# EAGLE schematic riffle-0.3 (EAGLE 7.2.0)
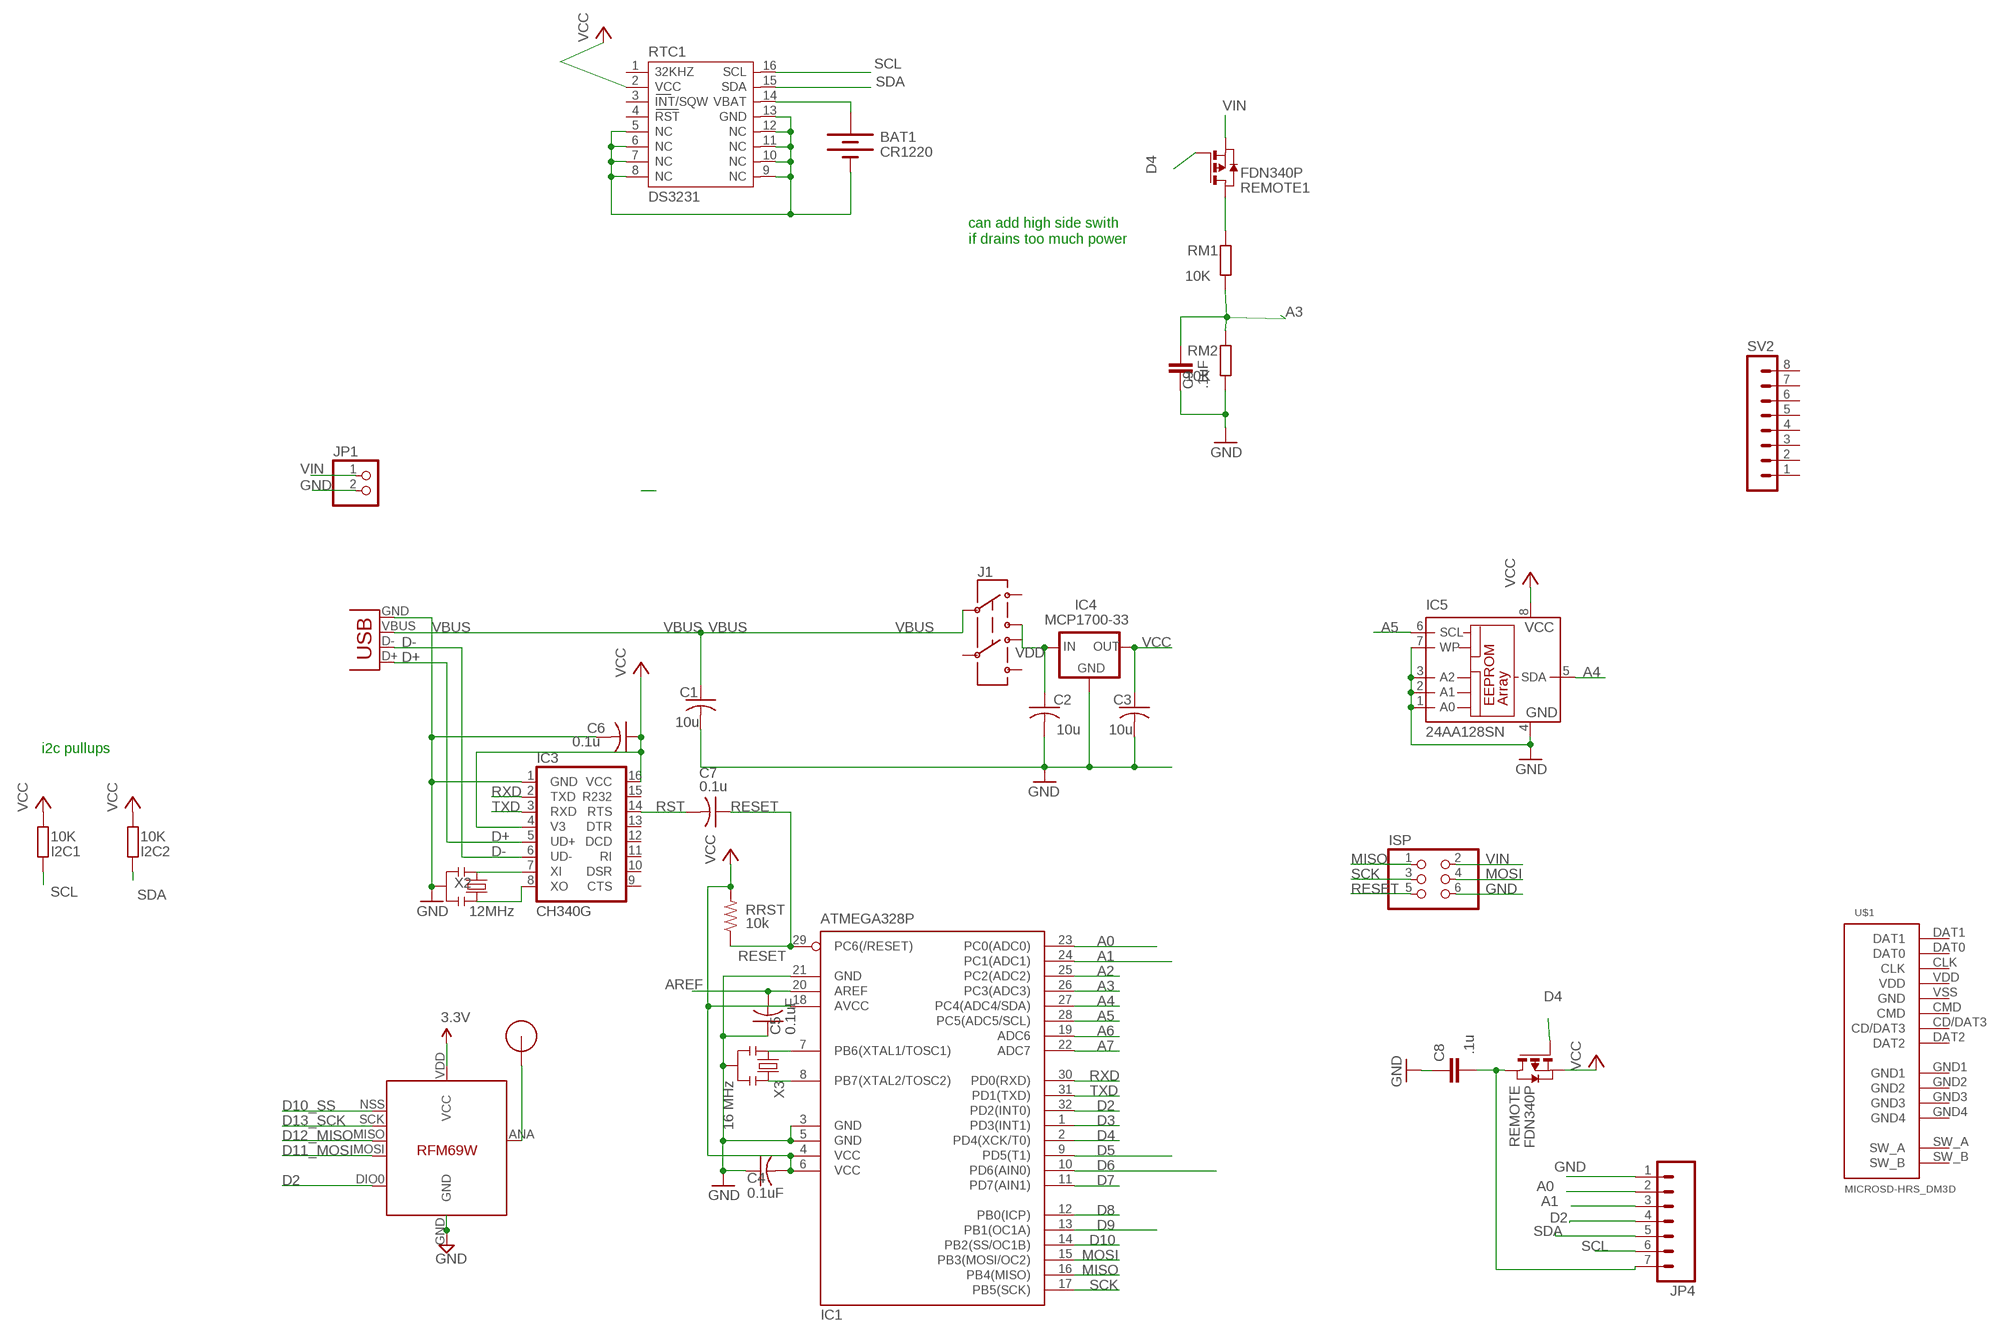
[diagram p0: schematic, sheet 1]

## Parts
BAT1  CR1220  BATTERYBATTERY_12MM_SMT  [BATTCON_12MM_SMT]
C1  10u  C-USC0805K  [C0805K]
C2  10u  C-USC0805K  [C0805K]
C3  10u  C-USC0805K  [C0805K]
C4  0.1uF  C-USC0805K  [C0805K]
C5  0.1uF  C-USC0805K  [C0805K]
C6  0.1u  C-USC0805K  [C0805K]
C7  0.1u  C-USC0805K  [C0805K]
C8  .1u  C-EUC0805  [C0805]
C9  .1uF  C-EUC0805  [C0805@1]
I2C1  10K  R-EU_R0805  [R0805]
I2C2  10K  R-EU_R0805  [R0805]
IC1  ATMEGA328P  MEGA8-AI  [TQFP32-08]
IC3  CH340G  [SO16]
IC4  MCP1700-33  MCP1700SOT89  [SOT89]
IC5  24AA128SN  [SO-08]
ISP  PINHD-2X3  [2X03]
J1  AYZ0202  [AYZ0202]
JP1  PINHD-1X2  [1X02]
JP4  M07  [1X07]
REMOTE  FDN340P  PMOSSOT23  [SOT-23]
REMOTE1  FDN340P  PMOSSOT23  [SOT-23]
RM1  10K  R-EU_R0805  [R0805]
RM2  10K  R-EU_R0805  [R0805]
RRST  10k  R-US_R0805  [R0805]
RTC1  DS3231  [DS3231]
SV2  MA08-1  [MA08-1]
U$1  MICROSD-HRS_DM3D  [DM3D]
U$3  RFM12B_ANTENNA  [RFM12B-ANTENNA]
U$5  RFM69  [RFM69W-MINPADS]
X1  USBSMD  [USB-MINIB]
X2  12MHz  RESONATORSMD  [RESONATOR-SMD]
X3  16 MHz  RESONATORSMD  [RESONATOR-SMD]

## Nets
A0: IC1.23(PC0(ADC0)) JP4.2
A1: IC1.24(PC1(ADC1)) JP4.3
A2: IC1.25(PC2(ADC2))
A3: C9.2 IC1.26(PC3(ADC3)) RM1.1 RM2.2
A4: IC1.27(PC4(ADC4/SDA)) IC5.5(SDA)
A5: IC1.28(PC5(ADC5/SCL)) IC5.6(SCL)
A6: IC1.19(ADC6)
A7: IC1.22(ADC7)
AREF: C5.2 IC1.20(AREF)
D2: IC1.32(PD2(INT0)) JP4.4 U$5.DIO0
D3: IC1.1(PD3(INT1))
D4: IC1.2(PD4(XCK/T0)) REMOTE1.3(G) REMOTE.3(G)
D5: IC1.9(PD5(T1))
D6: IC1.10(PD6(AIN0))
D7: IC1.11(PD7(AIN1))
D8: IC1.12(PB0(ICP))
D9: IC1.13(PB1(OC1A))
D10: IC1.14(PB2(SS/OC1B))
D10_SS: U$5.NSS(SEL)
D11_MOSI: U$5.MOSI
D12_MISO: U$5.MISO
D13_SCK: U$5.SCK
D+: IC3.5(UD+) X1.D+
D-: IC3.6(UD-) X1.D-
GND: BAT1.P$1(-) C1.2 C2.2 C3.2 C4.1 C5.1 C6.2 C8.1 C9.1 IC1.3(GND) IC1.5(GND) IC1.21(GND) IC3.1(GND) IC4.1(GND) IC5.1(A0) IC5.2(A1) IC5.3(A2) IC5.4(GND) IC5.7(WP) ISP.6 JP1.2 JP4.1 RM2.1 RTC1.5(NC) RTC1.6(NC) RTC1.7(NC) RTC1.8(NC) RTC1.9(NC) RTC1.10(NC) RTC1.11(NC) RTC1.12(NC) RTC1.13(GND) U$5.GND X1.GND X2.2 X3.2
MISO: IC1.16(PB4(MISO)) ISP.1
MOSI: IC1.15(PB3(MOSI/OC2)) ISP.4
N$1: U$3.P$1 U$5.ANA(ANT)
N$2: IC1.7(PB6(XTAL1/TOSC1)) X3.1
N$3: IC1.8(PB7(XTAL2/TOSC2)) X3.3
N$4: REMOTE1.1(D) RM1.2
N$7: C8.2 JP4.7 REMOTE.1(D)
N$11: IC3.7(XI) X2.1
N$13: IC3.8(XO) X2.3
RESET: C7.1 IC1.29(PC6(/RESET)) ISP.5 RRST.1
RST: C7.2 IC3.14(RTS)
RTC_BATT1: BAT1.P$2(+) RTC1.14(VBAT)
RXD: IC1.30(PD0(RXD)) IC3.2(TXD)
SCK: IC1.17(PB5(SCK)) ISP.3
SCL: I2C1.2 JP4.6 RTC1.16(SCL)
SDA: I2C2.2 JP4.5 RTC1.15(SDA)
TXD: IC1.31(PD1(TXD)) IC3.3(RXD)
VBUS [power]: C1.1 J1.2 X1.VBUS
VCC: C3.1 C4.2 C6.1 I2C1.1 I2C2.1 IC1.4(VCC) IC1.6(VCC) IC1.18(AVCC) IC3.4(V3) IC3.16(VCC) IC4.3(OUT) IC5.8(VCC) REMOTE.2(S) RRST.2 RTC1.2(VCC) U$5.VDD(VCC) ; supply symbol labelled 3.3V
VDD: C2.1 IC4.2(IN) J1.1
VIN [power]: ISP.2 JP1.1 REMOTE1.2(S)
Unconnected: IC3.9(CTS) IC3.10(DSR) IC3.11(RI) IC3.12(DCD) IC3.13(DTR) IC3.15(R232) J1.3 J1.4 J1.5 J1.6 RTC1.1(32KHZ) RTC1.3(INT/SQW) RTC1.4(RST) SV2.1 SV2.2 SV2.3 SV2.4 SV2.5 SV2.6 SV2.7 SV2.8 U$1.CD/DAT3 U$1.CLK U$1.CMD U$1.DAT0 U$1.DAT1 U$1.DAT2 U$1.GND1 U$1.GND2 U$1.GND3 U$1.GND4 U$1.SW_A U$1.SW_B U$1.VDD U$1.VSS(GND)

## Notes on the sheet
- can add high side swith
  if drains too much power
- i2c pullups

## Library data of the parts
BAT1 = SparkFunNew:BATTERY: Battery Holders Various common sizes : AA, AAA, 20mm coin cell and 12mm coin cell.
C1-C5 = adafruit2013:C-US: CAPACITOR, American symbol
C6 C7 = adafruit:C-US: CAPACITOR, American symbol
C8 = resistor:C-EU: CAPACITOR, European symbol
C9 = rcl:C-EU: CAPACITOR, European symbol
I2C1 I2C2 RM1 RM2 = rcl:R-EU_: RESISTOR, European symbol
IC1 = atmel:MEGA8: MICROCONTROLLER 8 Kbytes FLASH, 1 kbytes SRAM, 512 bytes EEPROM, USART, 6-channel 10 bit ADC, 2-channel 8 bit ADC Pin compatible with Atmega48, ATMega88, ATMega168 Source: avr.lbr; MPN: ATMEGA8-16AU; OC_FARNELL: 9171371; OC_NEWARK: 73M8863
IC3 = SparkFunNew:CH340
IC4 = adafruit:MCP1700: VOLTAGE REGULATOR
IC5 = microchip:24*: Serial EEPROM I2C; MF: MICROCHIP; MPN: 24AA128-I/SN; OC_FARNELL: unknown; OC_NEWARK: 92C6842
ISP = pinhead:PINHD-2X3: PIN HEADER
J1 = SparkFunNew:AYZ0202: SPDT Slide Switch Simple SMD single-pull double-throw slide switch. Good for less than 350mA power switch, switching UARTs between devices, etc. Spark Fun Electronics SKU : COM-00597
JP1 = pinhead:PINHD-1X2: PIN HEADER
JP4 = SparkFun-Connectors:M07: Header 7 Standard 7-pin 0.1" header. Use with straight break away headers (SKU : PRT-00116), right angle break away headers (PRT-00553), swiss pins (PRT-00743), machine pins (PRT-00117), and female headers (PRT-00115). NOTES ON THE VARIANTS LOCK and LOCK_LONGPADS... This footprint was designed to help hold the alignment of a through-hole component (i.e. 7-pin header) while soldering it into place. You may notice that each hole has been shifted either up or down by 0.005 of an inch from it's more standard position (which is usually a perfectly straight line). This slight alteration caused the pins (the squares in the middle) to touch the edges of the holes. Because they are alternating, it causes a "brace" to hold the header in place. 0.005 has proven to be the perfect amount of "off-center" position when using our standard breakaway headers. Although looks a little odd when you look at the bare footprint, once you have a header in there, the alteration is very hard to notice. Also, if you push a header all the way into place, it is covered up entirely on the bottom side. This idea of altering the position of holes to aid alignment will be further integrated into the Sparkfun Library for other footprints. It can help hold any component with 3 or more connection pins.
REMOTE REMOTE1 = zetex:PMOSSOT23: MOS FET
RRST = adafruit2013:R-US_: RESISTOR, American symbol
RTC1 = _lh-library:DS3231
SV2 = con-lstb:MA08-1: PIN HEADER; OC_FARNELL: unknown; OC_NEWARK: unknown
U$1 = hrs_DM3D-SF:MICROSD-HRS_DM3D
U$3 = LowPowerLab:RFM12B_ANTENNA
U$5 = LowPowerLab:RFM69
X1 = SparkFun:USB: USB Connectors USB-B-PTH is fully proven SKU : PRT-00139 USB-miniB is fully proven SKU : PRT-00587 USB-A-PCB is untested. USB-A-H is throughly reviewed, but untested. Spark Fun Electronics SKU : PRT-00437 USB-B-SMT is throughly reviewed, but untested. Needs silkscreen touching up. USB-A-S has not been used/tested USB-MB-H has not been used/tested
X2 = SparkFunNew:RESONATOR: Resonator Small SMD resonator. This is the itty bitty 10/20MHz resonators with built in caps. CSTCE10M0G55 and CSTCE20M0V53. Footprint has been reviewed closely but hasn't been tested yet.
X3 = SparkFun:RESONATOR: Resonator Small SMD resonator. This is the itty bitty 10/20MHz resonators with built in caps. CSTCE10M0G55 and CSTCE20M0V53. Footprint has been reviewed closely but hasn't been tested yet.

## Net classes
0 default: width 0.203 mm, drill 0.33 mm, clearance 0.203 mm
1 power: width 0.305 mm, clearance 0.203 mm